# EAGLE schematic MultiDrop (EAGLE 7.6.0)
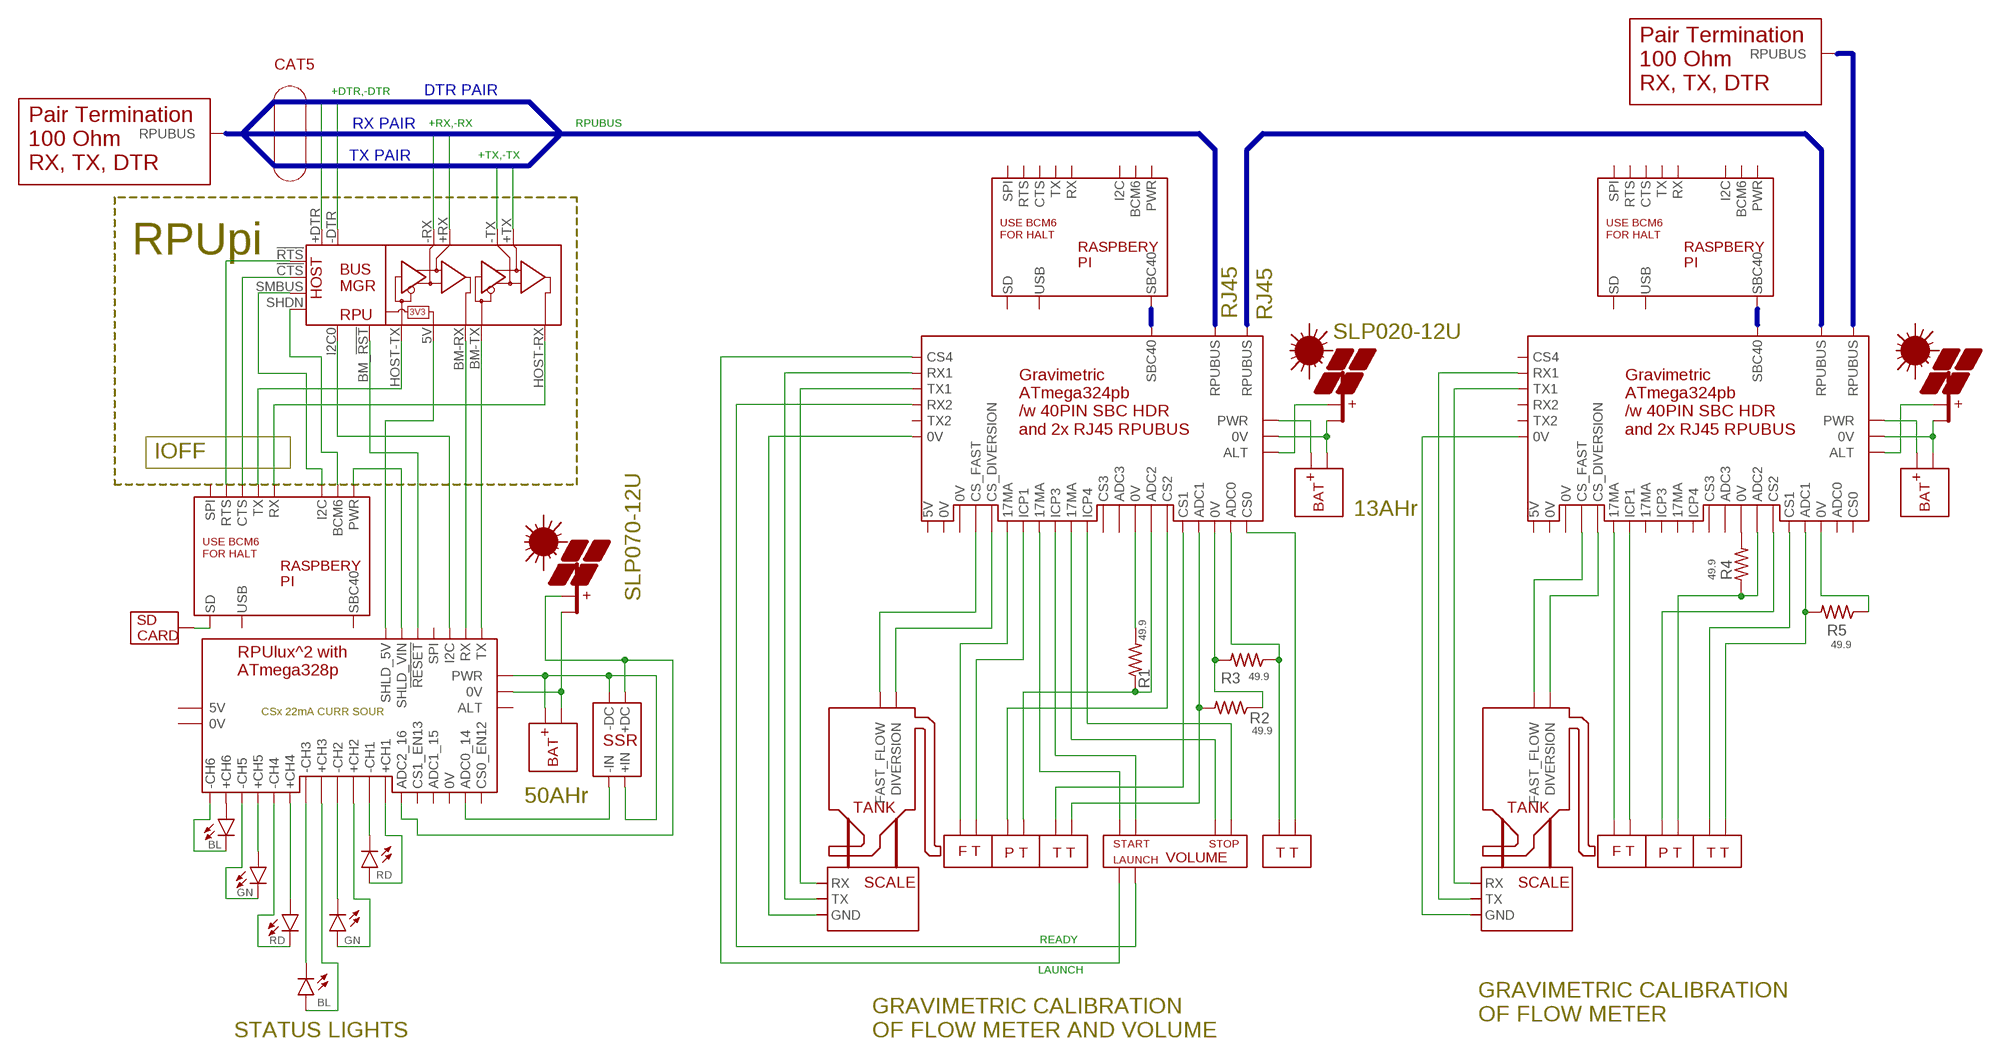
[diagram p0: schematic, sheet 1]

## Parts
BL1  BL  LED5MM  [LED5MM]
BL2  BL  LED5MM  [LED5MM]
GN1  GN  LED5MM  [LED5MM]
GN2  GN  LED5MM  [LED5MM]
PV1  PV  [NA-30]
PV2  PV  [NA-30]
PV4  PV  [NA-30]
R1  49.9  R0805  [C0805(2012)]
R2  49.9  R0805  [C0805(2012)]
R3  49.9  R0805  [C0805(2012)]
R4  49.9  R0805  [C0805(2012)]
R5  49.9  R0805  [C0805(2012)]
RD1  RD  LED5MM  [LED5MM]
RD2  RD  LED5MM  [LED5MM]
SD2  SD  [NA-30]
U$1  GRAVIMETRIC  [WITH_RPU_NAMES]
U$2  GRAVIMETRIC  [WITH_RPU_NAMES]
U$3  PI  [NA-30]
U$4  BUS_MGR  [WITH_RPU_NAMES]
U$5  TERM  [NA-30]
U$6  PI  [NA-30]
U$7  BAT  [NA-30]
U$8  SSR_DC  [NA-30]
U$9  BAT  [NA-30]
U$10  BAT  [NA-30]
U$11  FT  [NA-30]
U$12  PT  [NA-30]
U$13  TT  [NA-30]
U$14  TT  [NA-30]
U$15  VOLUME  [NA-30]
U$16  FT  [NA-30]
U$17  PT  [NA-30]
U$18  TT  [NA-30]
U$19  RPULUX  [WITH_RPU_NAMES]
U$20  PI  [NA-30]
U$21  SCALE  [NA-30]
U$22  SCALE  [NA-30]
U$23  TERM  [NA-30]

## Nets
+DTR3: U$4.+DTR
+RX3: U$4.+RX
+TX3: U$4.+TX
-DTR3: U$4.-DTR
-RX3: U$4.-RX
-TX3: U$4.-TX
LAUNCH: U$1.22MA@ADC4(CS4) U$15.5(LAUNCH)
N$1: R1.2 U$1.0V@ADC2(0V)
N$2: R4.2 U$2.0V@ADC2(0V)
N$3: PV1.1(+PV) U$1.BAT(ALT)
N$4: U$1.PWR U$10.1(+BAT)
N$5: U$1.22MA@DIO2(CS_DIVERSION) U$21.1(DIVERSION)
N$6: U$1.17MA@ICP1(17MA) U$11.2(PWR)
N$7: U$1.ICP1 U$11.1(PL)
N$8: U$1.17MA@ICP3(17MA) U$15.2(START)
N$9: U$1.ICP3 U$15.3(STAR_RTN)
N$10: U$1.22MA@DIO9(CS_FAST) U$21.5(FAST_FLOW)
N$11: U$1.K3(TX1) U$21.4(RX)
N$12: U$3.7(BCM6) U$4.SHDN
N$13: U$4.5V(PWR) U$19.SHLD_5V
N$14: U$4.BM-TX(BM_TX) U$19.TX
N$15: U$3.8(I2C) U$4.SMBUS
N$16: U$8.4(-IN) U$19.ADC0(ADC0_14)
N$17: U$1.K1(RX1) U$21.3(TX)
N$18: U$2.PWR U$9.1(+BAT)
N$19: PV2.1(+PV) U$2.BAT(ALT)
N$20: U$1.17MA@ICP4(17MA) U$15.1(STOP)
N$21: U$4.BM-RX(BM_RX) U$19.RX
N$22: U$3.1(CTS) U$4.!CTS
N$23: U$3.2(RTS) U$4.!RTS
N$24: U$1.ICP4 U$15.4(STOP_RTN)
N$25: BL2.A U$19.+CH6
N$26: U$3.3(RX) U$4.HOST-RX(HOST_RX)
N$27: U$3.4(TX) U$4.HOST-TX(HOST_TX)
N$28: SD2.1(PV_PWR) U$3.9(SD)
N$29: U$1.0V@DIO9(0V) U$21.2(GND)
N$30: U$2.22MA@DIO2(CS_DIVERSION) U$22.1(DIVERSION)
N$31: U$1.22MA@ADC1(CS0) U$13.1(4TO20)
N$32: U$4.I2C0 U$19.I2C
N$33: U$2.22MA@DIO9(CS_FAST) U$22.5(FAST_FLOW)
N$34: R3.1 U$1.ADC1(ADC0) U$13.2(PWR)
N$35: R2.2 U$1.ADC0(ADC1) U$14.1(4TO20)
N$36: U$1.22MA@ADC0(CS1) U$14.2(PWR)
N$37: R1.1 U$1.ADC2 U$12.1(4TO20)
N$38: PV1.2(-PV) U$1.0V@PWR(0V) U$10.2(-BAT)
N$39: PV2.2(-PV) U$2.0V@PWR(0V) U$9.2(-BAT)
N$40: RD2.A U$19.+CH4
N$41: U$3.12(PWR) U$19.SHLD_VOUT(SHLD_VIN)
N$42: PV4.2(-PV) U$7.2(-BAT) U$19.0V@PWR(0V)
N$43: U$4.BM_!RST!(BM-!RST!) U$19.!RESET
N$44: U$2.K3(TX1) U$22.4(RX)
N$45: U$2.K1(RX1) U$22.3(TX)
N$46: RD2.K U$19.-CH4
N$47: GN2.A U$19.+CH5
N$48: U$2.0V@DIO9(0V) U$22.2(GND)
N$49: GN2.K U$19.-CH5
N$50: U$1.22MA@ADC2(CS2) U$12.2(PWR)
N$51: BL2.K U$19.-CH6
N$53: R2.1 R3.2 U$1.0V@ADC1(0V)
N$54: U$2.17MA@ICP1(17MA) U$16.2(PWR)
N$55: U$2.ICP1 U$16.1(PL)
N$56: R4.1 U$2.ADC2 U$17.1(4TO20)
N$57: U$2.22MA@ADC2(CS2) U$17.2(PWR)
N$58: R5.2 U$2.ADC0(ADC1) U$18.1(4TO20)
N$59: U$2.22MA@ADC0(CS1) U$18.2(PWR)
N$61: R5.1 U$2.0V@ADC1(0V)
N$62: RD1.K U$19.-CH1
N$63: PV4.1(+PV) U$8.1(+DC) U$19.ADC2(ADC2_16)
N$64: U$7.1(+BAT) U$8.2(+IN) U$8.3(-DC) U$19.PWR
N$65: RD1.A U$19.+CH1
N$66: GN1.A U$19.+CH2
N$67: GN1.K U$19.-CH2
N$68: BL1.A U$19.+CH3
N$69: BL1.K U$19.-CH3
READY: U$1.K2(RX2) U$15.6(READY)
Unconnected: U$1.0V U$1.0V@DIO2(0V) U$1.5V U$1.22MA@ADC3(CS3) U$1.+RX(RPUBUS) U$1.+TX(RPUBUS) U$1.ADC3 U$1.K4(TX2) U$1.SPI(SBC40) U$2.0V U$2.0V@DIO2(0V) U$2.5V U$2.17MA@ICP3(17MA) U$2.17MA@ICP4(17MA) U$2.22MA@ADC1(CS0) U$2.22MA@ADC3(CS3) U$2.22MA@ADC4(CS4) U$2.+RX(RPUBUS) U$2.+TX(RPUBUS) U$2.ADC1(ADC0) U$2.ADC3 U$2.ICP3 U$2.ICP4 U$2.K2(RX2) U$2.K4(TX2) U$2.SPI(SBC40) U$3.5(SBC40) U$3.10(SPI) U$3.11(USB) U$5.1(RPUBUS) U$6.1(CTS) U$6.2(RTS) U$6.3(RX) U$6.4(TX) U$6.5(SBC40) U$6.7(BCM6) U$6.8(I2C) U$6.9(SD) U$6.10(SPI) U$6.11(USB) U$6.12(PWR) U$19.0V U$19.0V@DIO2(0V) U$19.5V U$19.22MA@ADC0(CS0_EN12) U$19.22MA@ADC1(CS1_EN13) U$19.ADC1(ADC1_15) U$19.AUX(ALT) U$19.SPI U$20.1(CTS) U$20.2(RTS) U$20.3(RX) U$20.4(TX) U$20.5(SBC40) U$20.7(BCM6) U$20.8(I2C) U$20.9(SD) U$20.10(SPI) U$20.11(USB) U$20.12(PWR) U$23.1(RPUBUS)

## Buses
RPUBUS
+RX,-RX
+TX,-TX
B$1
B$2
B$3
B$4
+DTR,-DTR
B$5

## Notes on the sheet
- CAT5
- DTR PAIR
- RX PAIR
- TX PAIR
- RPUpi
- RJ45 | RJ45
- SLP020-12U
- IOFF
- 13AHr
- SLP070-12U
- 50AHr
- GRAVIMETRIC CALIBRATION
  OF FLOW METER
- STATUS LIGHTS
- GRAVIMETRIC CALIBRATION
  OF FLOW METER AND VOLUME

## Library data of the parts
BL1 BL2 GN1 GN2 RD1 RD2 = D-LED:LED: LED 120120WH [CREE,XHGAWT-00-0000-00000HXE1] LED WHITE 6500K 150LUM-W120120
PV1 PV2 PV4 = Documentation:PV
R1-R5 = R-C:R: Resiistor American-style symbol
SD2 = Documentation:SD
U$1 U$2 = Documentation:GRAVIMETRIC
U$3 U$6 U$20 = Documentation:PI: Raspbery Pi
U$4 = Documentation:BUS_MGR: RPU BUS MANAGER
U$5 U$23 = Documentation:TERM: Pair Termination 100 Ohm RX, TX, DTR
U$7 U$9 U$10 = Documentation:BAT
U$8 = Documentation:SSR_DC: Crydom DR06D06 din mount 6A 4..32VIN 60Vload
U$11 U$16 = Documentation:FT
U$12 U$17 = Documentation:PT
U$13 U$14 U$18 = Documentation:TT
U$15 = Documentation:VOLUME
U$19 = Documentation:RPULUX
U$21 U$22 = Documentation:SCALE